# Altium schematic sheet Buttons.SchDoc
size A
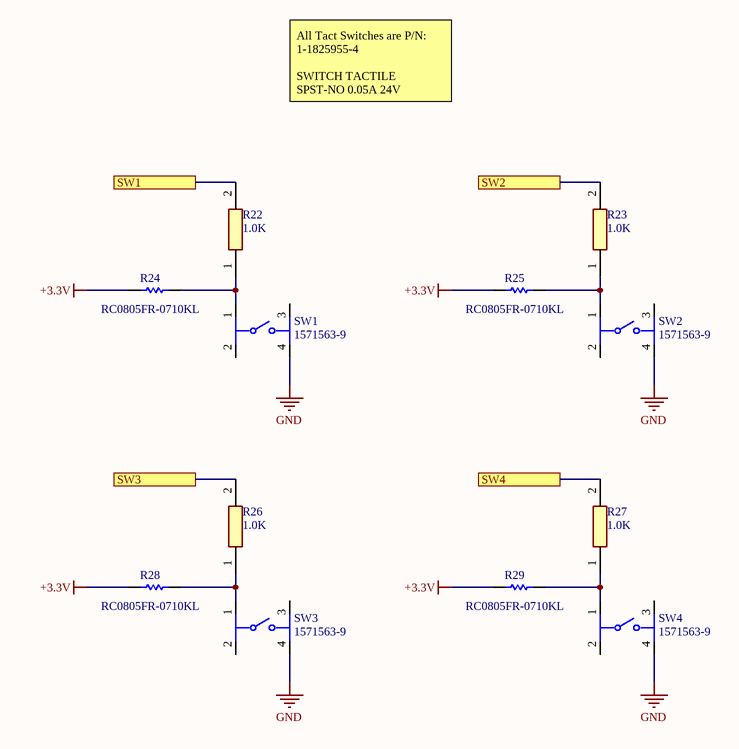
[diagram p0: Buttons.SchDoc]

## Parts
R22  1.0K  [RESC2012X60N]
R23  1.0K  [RESC2012X60N]
R24  RC0805FR-0710KL  [RESC2013X60X35NL10T20]
R25  RC0805FR-0710KL  [RESC2013X60X35NL10T20]
R26  1.0K  [RESC2012X60N]
R27  1.0K  [RESC2012X60N]
R28  RC0805FR-0710KL  [RESC2013X60X35NL10T20]
R29  RC0805FR-0710KL  [RESC2013X60X35NL10T20]
SW1  1571563-9  [FP-1571563-9-MFG]
SW2  1571563-9  [FP-1571563-9-MFG]
SW3  1571563-9  [FP-1571563-9-MFG]
SW4  1571563-9  [FP-1571563-9-MFG]

## Ports
SW1, SW2, SW3, SW4

## Nets
+3.3V: R24.1 R25.1 R28.1 R29.1
GND: SW1.4 SW2.4 SW3.4 SW4.4
SW1: R22.2 ; port SW1
SW2: R23.2 ; port SW2
SW3: R26.2 ; port SW3
SW4: R27.2 ; port SW4
NetR22_1: R22.1 R24.2 SW1.1
NetR23_1: R23.1 R25.2 SW2.1
NetR26_1: R26.1 R28.2 SW3.1
NetR27_1: R27.1 R29.2 SW4.1

Not connected (* = marked no-connect by the designer): SW1 2 3; SW2 2 3; SW3 2 3; SW4 2 3

## Notes on the sheet
- All Tact Switches are P/N: 1-1825955-4
  SWITCH TACTILE SPST-NO 0.05A 24V

## Library data of the parts
R22 R23 R26 R27 = RC0805JR-071KL: Resistor; Manufacturer_Name: YAGEO (PHYCOMP); Datasheet Link: http://www.yageo.com/documents/recent/PYu-RC_Group_51_RoHS_L_10.pdf; Height: 0.6mm; Manufacturer_Part_Number: RC0805JR-071KL; Arrow Part Number: RC0805JR-071KL; Arrow Price/Stock: https://www.arrow.com/en/products/rc0805jr-071kl/yageo; Mouser Part Number: 603-RC0805JR-071KL; Mouser Price/Stock: https://www.mouser.co.uk/ProductDetail/Yageo/RC0805JR-071KL?qs=KyGMWp10UkuwbpWNcSKeOA%3D%3D
R24 R25 R28 R29 = CMP-1659-00013-4: Chip Resistor, 10 KOhm, +/- 1%, 0.125 W, -55 to 155 degC, 0805 (2012 Metric), RoHS, Tape and Reel; Manufacturer: Yageo; Voltage Rating: 150 V; Mount: Surface Mount; ComponentLink1Description: Manufacturer URL; ComponentLink2URL: http://www.yageo.com/documents/recent/PYu-RC_Group_51_RoHS_L_04.pdf; Pins: 2; Length: 2 mm; Min Operating Temperature: -55 degC; Height: 0.5 mm; Mounting Technology: Surface Mount; RoHSCompliant: true; REACH SVHC: No SVHC; ComponentLink1URL: http://www.yageo.com/; Max Operating Temperature: 155 degC; PackageReference: 0805; DatasheetVersion: Rev. 4, 02/2016; Package Quantity: 5000; Packaging: Tape and Reel; ComponentLink2Description: Datasheet; PackageDescription: 2-Pin Surface Mounted Device, Body 2 x 1.25 mm
SW1-SW4 = CMP-03402-000005-1: SWITCH TACTILE SPST-NO 0.05A 24V; Manufacturer: TE Connectivity; Standoff Height: 0.05mm; Electromechanical Life: 100000Cycles; Contact Resistance: 100mΩ; Operating Force: 160gf; Contact Current Rating: 50mA; Automotive: No; Device Class L1: Electromechanical; Voltage Rating Dc: 24V; ComponentLink2Description: Datasheet; Mount: Surface Mount; RoHS: TRUE; Temperature: -35°C to +85°C; ComponentLink2URL: https://www.te.com/commerce/DocumentDelivery/DDEController?Action=showdoc&DocId=Customer+Drawing%7F2-1437565-7%7FV%7Fpdf%7FEnglish%7FENG_CD_2-1437565-7_V.pdf%7F1571563-9; Manufacturer Part Number: 1571563-9; Temperature Range Low: -35°C; Lead Free: Yes; Device Class L2: Switches; Package: SMT_SW_6MM0_6MM0; Octopart: https://octopart.com/1571563-9-te+connectivity-41253969; Throw Configuration: SPST-NO; Mouser Description: Tactile Switches SPST OFF(ON) RND SMT MINI PB TACT SWITCH; Temperature Range High: +85°C; Digikey Description: SWITCH TACTILE SPST-NO 0.05A 24V; Device Class L3: Pushbutton Switches; Category: Switch; Height: 9.75mm